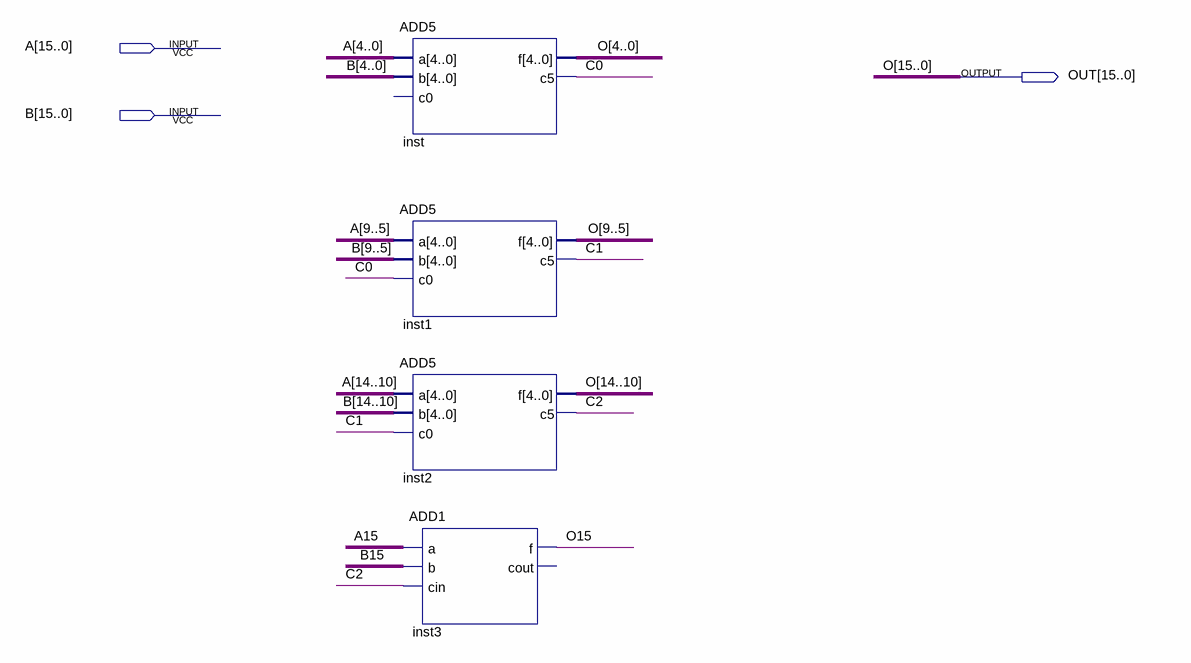
[diagram p0: schematic sheet]
// Quartus schematic ADD16.bdf as structural Verilog: 4 symbols, 3 pins
module ADD16 (
  input  [15:0] A,
  input  [15:0] B,
  output [15:0] OUT
);

  wire C0, C1, C2;

  ADD5 inst (.a(A[4:0]), .b(B[4:0]), .f(OUT[4:0]), .c5(C0));  // open: c0
  ADD5 inst1 (.a(A[9:5]), .b(B[9:5]), .c0(C0), .f(OUT[9:5]), .c5(C1));
  ADD5 inst2 (.a(A[14:10]), .b(B[14:10]), .c0(C1), .f(OUT[14:10]), .c5(C2));
  ADD1 inst3 (.a(A[15]), .b(B[15]), .cin(C2), .f(OUT[15]));  // open: cout

  // Other names for the same wires on the sheet: O[15:0] = OUT; O15 = OUT[15]
endmodule
